# EasyEDA Pro project 通信+控制电路板.epro, schematic Schematic2
Board Name: Board2; Create Date: 2025-07-15; Page Name: P1; Project Name: 机器狗分电通信板; Schematic Name: Schematic2; Update Date: 2025-07-18; Company: 嘉立创EDA; Page Size: A4; Version: V1.0
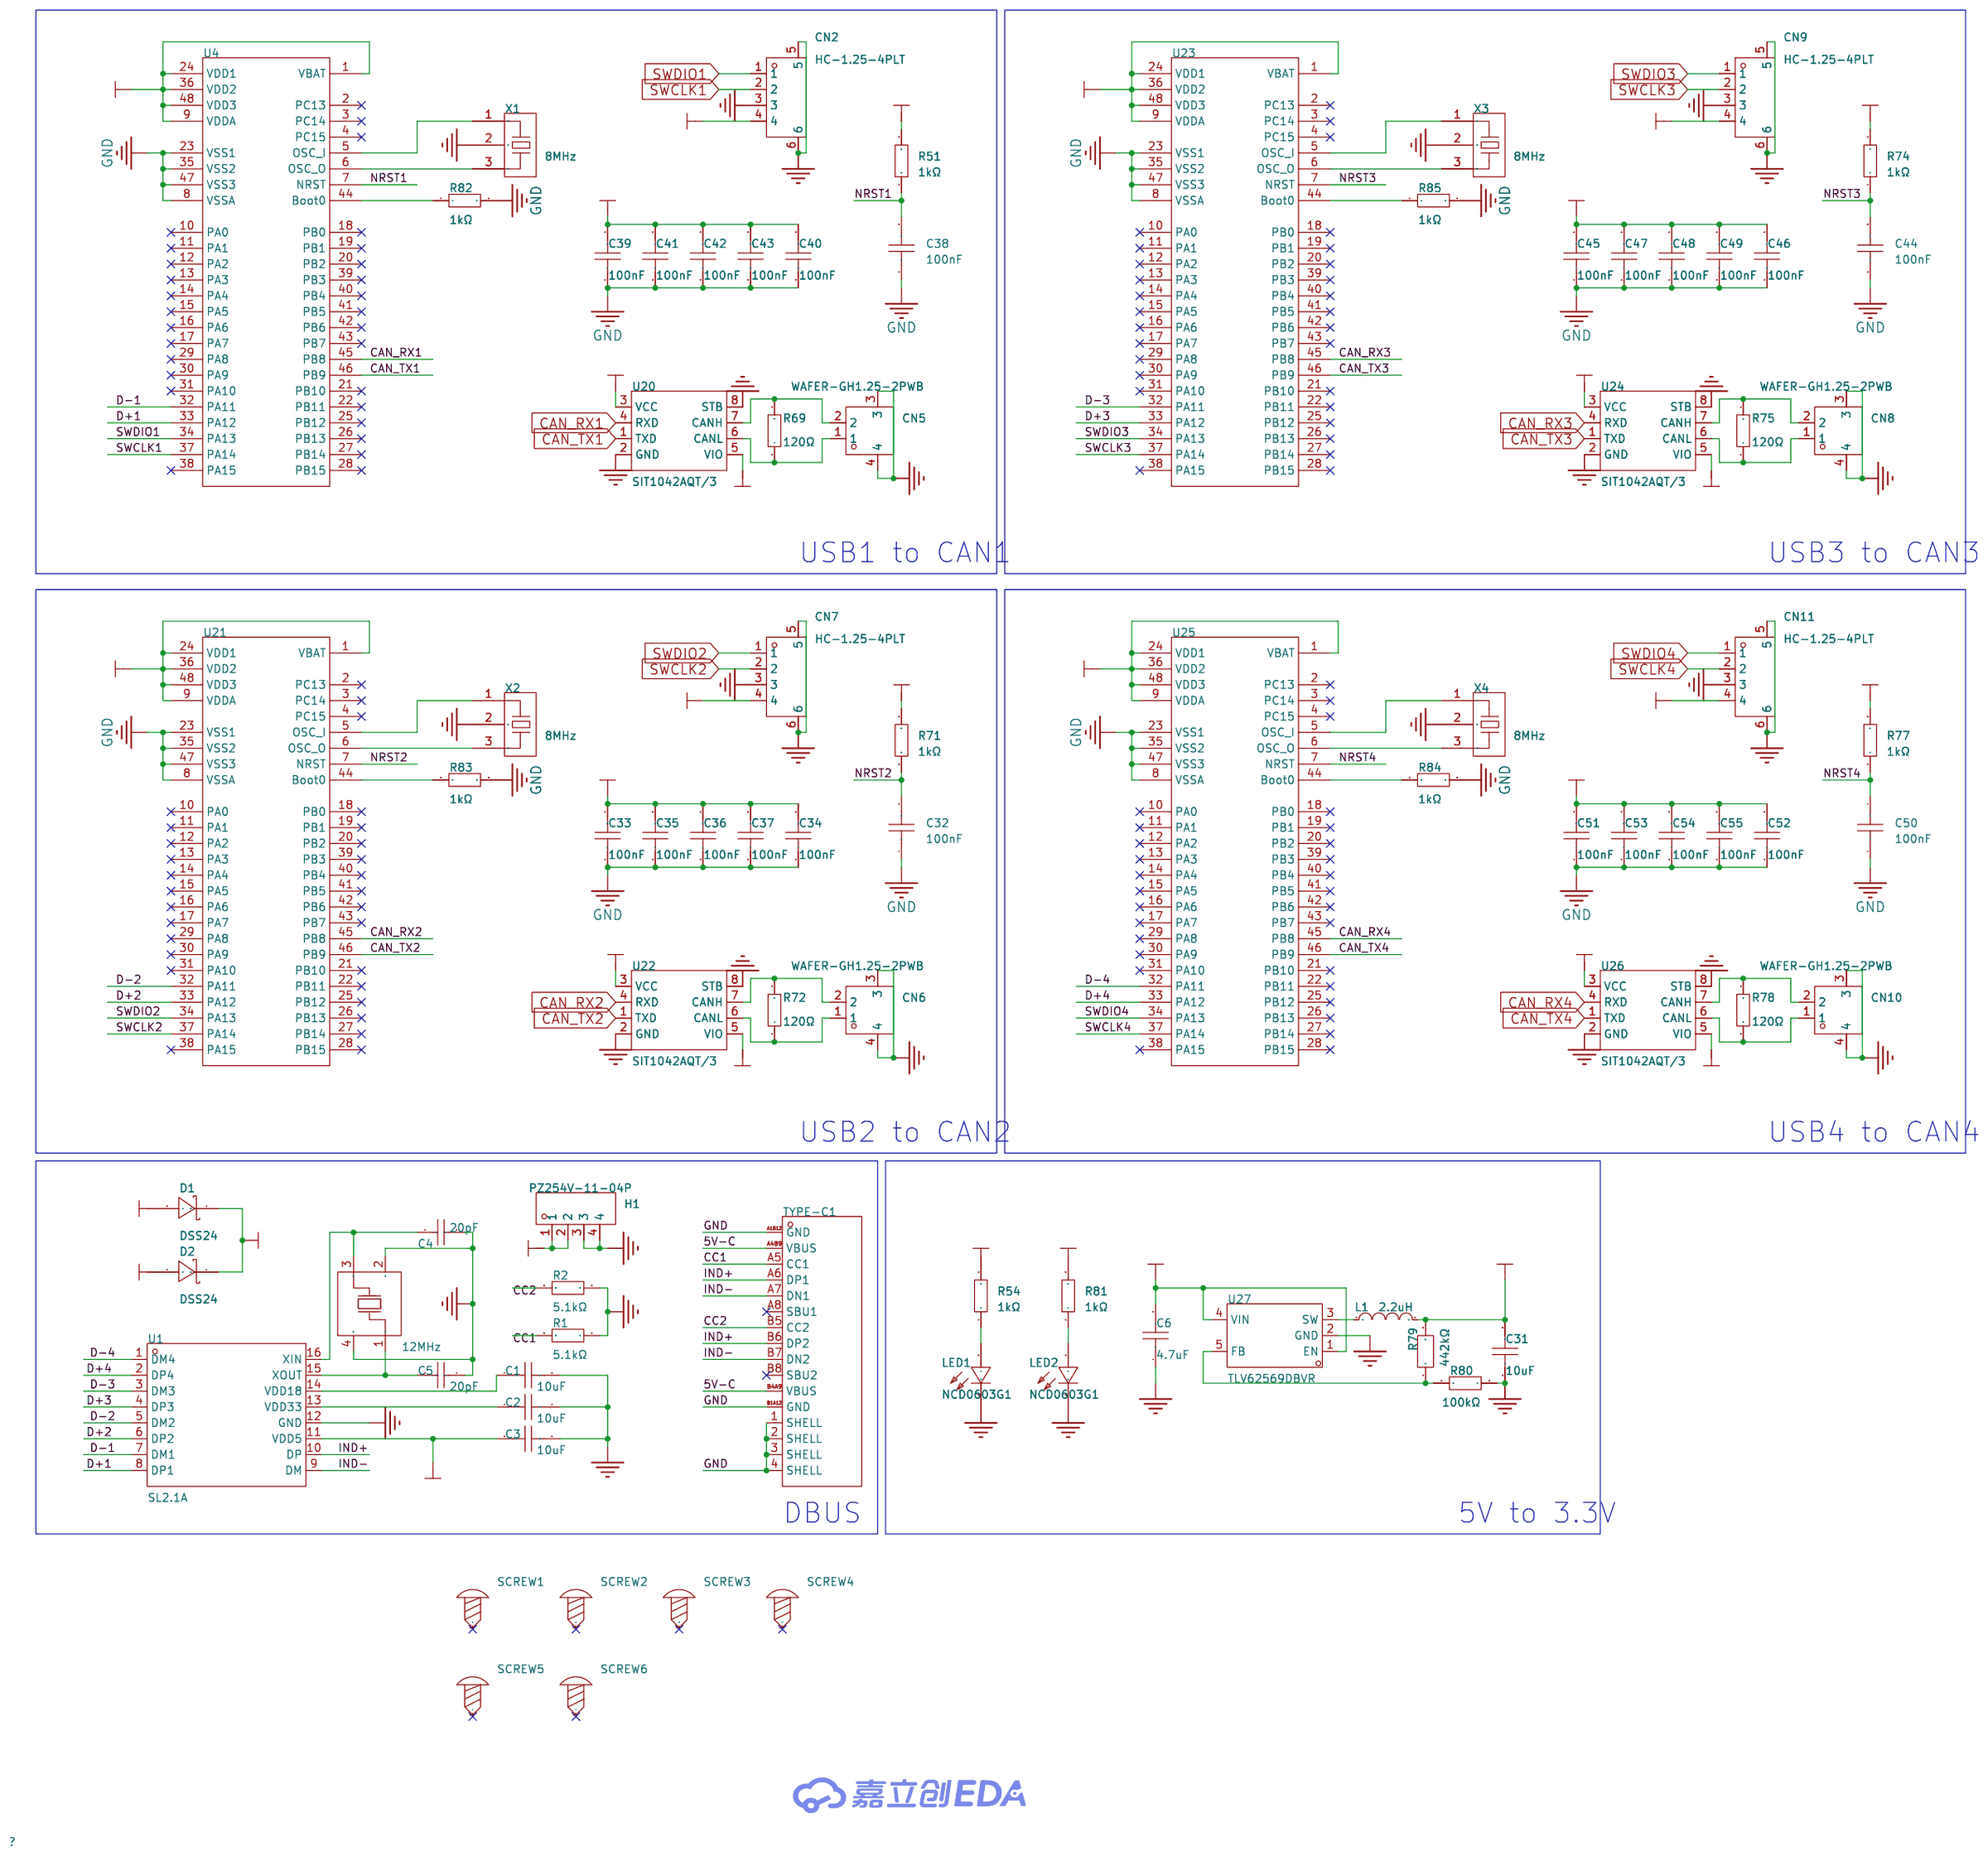
[diagram p1: schematic sheet]

## Parts
C1  10uF  [C0603]
C2  10uF  [C0603]
C3  10uF  [C0603]
C4  20pF  [C0603]
C5  20pF  [C0603]
C6  4.7uF  [C0603]
C31  10uF  [C0603]
C32  100nF  [C0603]
C33  100nF  [C0603]
C34  100nF  [C0603]
C35  100nF  [C0603]
C36  100nF  [C0603]
C37  100nF  [C0603]
C38  100nF  [C0603]
C39  100nF  [C0603]
C40  100nF  [C0603]
C41  100nF  [C0603]
C42  100nF  [C0603]
C43  100nF  [C0603]
C44  100nF  [C0603]
C45  100nF  [C0603]
C46  100nF  [C0603]
C47  100nF  [C0603]
C48  100nF  [C0603]
C49  100nF  [C0603]
C50  100nF  [C0603]
C51  100nF  [C0603]
C52  100nF  [C0603]
C53  100nF  [C0603]
C54  100nF  [C0603]
C55  100nF  [C0603]
CN2  HC-1.25-4PLT  [CONN-SMD_4P-P1.25_HCTL_HC-1.25-4PLT]
CN5  WAFER-GH1.25-2PWB  [CONN-TH_2P-P1.25_XUNPU_WAFER-GH1.25-2PWB]
CN6  WAFER-GH1.25-2PWB  [CONN-TH_2P-P1.25_XUNPU_WAFER-GH1.25-2PWB]
CN7  HC-1.25-4PLT  [CONN-SMD_4P-P1.25_HCTL_HC-1.25-4PLT]
CN8  WAFER-GH1.25-2PWB  [CONN-TH_2P-P1.25_XUNPU_WAFER-GH1.25-2PWB]
CN9  HC-1.25-4PLT  [CONN-SMD_4P-P1.25_HCTL_HC-1.25-4PLT]
CN10  WAFER-GH1.25-2PWB  [CONN-TH_2P-P1.25_XUNPU_WAFER-GH1.25-2PWB]
CN11  HC-1.25-4PLT  [CONN-SMD_4P-P1.25_HCTL_HC-1.25-4PLT]
D1  DSS24  [SOD-123_L2.8-W1.8-LS3.7-RD]
D2  DSS24  [SOD-123_L2.8-W1.8-LS3.7-RD]
H1  PZ254V-11-04P  [HDR-TH_4P-P2.54-V-M]
L1  2.2uH  [IND-SMD_L4.4-W4.2]
LED1  NCD0603G1  [LED0603-RD_1]
LED2  NCD0603G1  [LED0603-RD_1]
R1  5.1kΩ  [R0603]
R2  5.1kΩ  [R0603]
R51  1kΩ  [R0603]
R54  1kΩ  [R0603]
R69  120Ω  [R0603]
R71  1kΩ  [R0603]
R72  120Ω  [R0603]
R74  1kΩ  [R0603]
R75  120Ω  [R0603]
R77  1kΩ  [R0603]
R78  120Ω  [R0603]
R79  442kΩ  [R0603]
R80  100kΩ  [R0603]
R81  1kΩ  [R0603]
R82  1kΩ  [R0603]
R83  1kΩ  [R0603]
R84  1kΩ  [R0603]
R85  1kΩ  [R0603]
SCREW1  -  [M2螺丝]
SCREW2  -  [M2螺丝]
SCREW3  -  [M2螺丝]
SCREW4  -  [M2螺丝]
SCREW5  -  [M2螺丝]
SCREW6  -  [M2螺丝]
TYPE-C1  TYPE-C16PIN  [TYPE-C 16P 插件]
U1  SL2.1A  [SOP-16_L10.0-W3.9-P1.27-LS6.0-BL]
U4  STM32F072C8T6  [LQFP-48_L7.0-W7.0-P0.50-LS9.0-BL]
U20  SIT1042AQT/3  [SOIC-8_L4.9-W3.9-P1.27-LS6.0-BL]
U21  STM32F072C8T6  [LQFP-48_L7.0-W7.0-P0.50-LS9.0-BL]
U22  SIT1042AQT/3  [SOIC-8_L4.9-W3.9-P1.27-LS6.0-BL]
U23  STM32F072C8T6  [LQFP-48_L7.0-W7.0-P0.50-LS9.0-BL]
U24  SIT1042AQT/3  [SOIC-8_L4.9-W3.9-P1.27-LS6.0-BL]
U25  STM32F072C8T6  [LQFP-48_L7.0-W7.0-P0.50-LS9.0-BL]
U26  SIT1042AQT/3  [SOIC-8_L4.9-W3.9-P1.27-LS6.0-BL]
U27  TLV62569DBVR  [SOT-23-5_L3.0-W1.7-P0.95-LS2.8-BR]
X1  8MHz  [OSC-SMD_3P-L3.2-W1.3-P1.2-L]
X2  8MHz  [OSC-SMD_3P-L3.2-W1.3-P1.2-L]
X3  8MHz  [OSC-SMD_3P-L3.2-W1.3-P1.2-L]
X4  8MHz  [OSC-SMD_3P-L3.2-W1.3-P1.2-L]
Y1  12MHz  [3225 贴片晶振_1]

## Library data of the parts
C1-C3 C31 = CGA0603X5R106K100JT: 容值:10uF;精度:±10%;额定电压:10V;温度系数:X5R;; LCSC Part Name: 10uF ±10% 10V; Supplier Part: C6119842; Manufacturer: HRE(芯声); Supplier Footprint: 0603; JLCPCB Part Class: 扩展库; Supplier: LCSC; Tolerance: ±10%; Voltage Rating: 10V; Temperature Coefficient: X5R
C4 C5 = CL10C200JB8NNNC: 容值:20pF;精度:±5%;额定电压:50V;材质(温度系数):C0G;; LCSC Part Name: 20pF ±5% 50V; Supplier Part: C1648; Manufacturer: SAMSUNG(三星); Supplier Footprint: 0603; JLCPCB Part Class: 基础库; Datasheet: https://atta.szlcsc.com/upload/public/pdf/source/20160218/1457707763339.pdf; Supplier: LCSC; Tolerance: ±5%; Voltage Rated: 50V; Temperature Coefficient: C0G
C6 = CL10A475KO8NNNC: 容值:4.7uF;精度:±10%;额定电压:16V;材质(温度系数):X5R;; LCSC Part Name: 4.7uF ±10% 16V; Supplier Part: C19666; Manufacturer: SAMSUNG(三星); Supplier Footprint: 0603; JLCPCB Part Class: 基础库; Datasheet: https://atta.szlcsc.com/upload/public/pdf/source/20160218/1457707763339.pdf; Supplier: LCSC; Tolerance: ±10%; Voltage Rated: 16V; Temperature Coefficient: X5R
C32-C55 = CGA0603X7R104K500JT: 容值:100nF;精度:±10%;额定电压:50V;温度系数:X7R;; LCSC Part Name: 100nF ±10% 50V; Supplier Part: C6119867; Manufacturer: HRE(芯声); Supplier Footprint: 0603; JLCPCB Part Class: 扩展库; Datasheet: https://atta.szlcsc.com/upload/public/pdf/source/20250103/C44077DA9E7B3EFAE02F22B6D3D1CBC9.pdf; Supplier: LCSC; Tolerance: ±10%; Voltage Rating: 50V; Temperature Coefficient: X7R
CN2 CN7 CN9 CN11 = HC-1.25-4PLT: 插针结构:1x4P;间距:1.25mm;安装方式:立贴;参考系列:PicoBlade(MX 1.25);总PIN数:4P;排数:1;每排PIN数:4;行距:-;额定电流:2A;触头材质:黄铜;触头镀层:锡;工作温度范围:-25℃~+85℃;; LCSC Part Name: 1x4P 间距:1.25mm 立贴 系列:PicoBlade(MX 1.25); Supplier Part: C2845390; Manufacturer: HCTL(华灿天禄); Supplier Footprint: SMD,P=1.25mm; JLCPCB Part Class: 扩展库; Datasheet: https://atta.szlcsc.com/upload/public/pdf/source/20230707/8E5913B5A3195C18F5EE12EA4CB86B82.pdf; Supplier: LCSC; Pins Structure: 1x4P; Pitch: 1.25mm; Mounting Style: 立贴; Reference Series: PicoBlade(MX 1.25); Number of Pins: 4P; Number of Rows: 1; Number of PINs Per Row: 4; Current Rating (Max): 2A; Contact Material: 黄铜; Contact Plating: 锡; Operating Temperature Range: -25℃~+85℃; Rated Voltage (Max): 250V; Plastic Material: LCP; Flame Retardant Rating: UL94V-0; Supplementary Features: 辅助焊脚; Z-Height of the Board: 4.75mm; X-Length of Bottom Edge on Board (Spacing Line): 9.8mm; Y-Width of Bottom Edge on Board: 4.2mm
CN5 CN6 CN8 CN10 = WAFER-GH1.25-2PWB: 插针结构:1x2P;间距:1.25mm;安装方式:卧贴;参考系列:GH;总PIN数:2P;排数:1;每排PIN数:2;行距:-;额定电流:1A;触头材质:黄铜;触头镀层:-;工作温度范围:-25℃~+85℃;; LCSC Part Name: 1x2P 间距:1.25mm 卧贴 系列:GH; Supplier Part: C3029377; Manufacturer: XUNPU(讯普); Supplier Footprint: SMD,P=1.25mm,卧贴; JLCPCB Part Class: 扩展库; Datasheet: https://atta.szlcsc.com/upload/public/pdf/source/20220527/CB8773BFB0913C3B8ABD62CB38BA101A.pdf; Supplier: LCSC; Pins Structure: 1x2P; Pitch: 1.25mm; Mounting Type: 卧贴; Reference Series: GH; Number of Pins: 2P; Number of Rows: 1; Number of PINs Per Row: 2; Current Rating: 1A; Contact Material: 黄铜; Operating Temperature: -25℃~+85℃; Voltage Rating: 125V; Plastic Material: LCP; Supplementary Features: 辅助焊脚; Color: 米色; Z-Height of the Board: 4.35mm; X-Length of Bottom Edge on Board (Spacing Line): 5.75mm; Y-Width of Bottom Edge on Board: 5mm
D1 D2 = DSS24: 正向压降(Vf):550mV@2A;直流反向耐压(Vr):40V;整流电流:2A;; LCSC Part Name: 电压:40V 电流:2A; Supplier Part: C511865; Manufacturer: BORN(伯恩半导体); Supplier Footprint: SOD-123FL; JLCPCB Part Class: 扩展库; Datasheet: https://atta.szlcsc.com/upload/public/pdf/source/20200413/C511865_530A4A8DFA4BF76EA49400B00C28BC33.pdf; Supplier: LCSC; Voltage - Forward(Vf@If): 550mV@2A; Voltage - DC Reverse(Vr): 40V; Current - Rectified: 2A
H1 = PZ254V-11-04P: 插针结构:1x4P;间距:2.54mm;行距:-;圆针/方针:方针;安装类型:直插;排数:单排;总PIN位数:4P;额定电流:3A;额定电压:250V;配合针长度:6mm;塑高:2.5mm;端接针长度:3mm;触头材质:-;工作温度范围:-40℃~+105℃;颜色:黑色;; LCSC Part Name: 间距:2.54mm 1x4P 直插 方针; Supplier Part: C2691448; Manufacturer: XFCN(兴飞); Supplier Footprint: 插件,P=2.54mm; JLCPCB Part Class: 扩展库; Datasheet: https://atta.szlcsc.com/upload/public/pdf/source/20200309/C492403_F9F19131791D08044AD4F84F8E751A34.pdf; Supplier: LCSC; Pin Structure: 1x4P; Pitch: 2.54mm; Circluar Pins/Square Pins: 方针; Mounting Type: 直插; Number of Rows: 单排; Number of Pins: 4P; Current Rating (Max): 3A; Voltage Rating (Max): 250V; Length of Mating Pin: 6mm; Insulation Height: 2.5mm; Length of End Connection Pin: 3mm; Operating Temperature Range: -40℃~+105℃; Color: 黑色
L1 = FXL0420-2R2-M: 电感值:2.2uH;精度:±20%;额定电流:4.5A;饱和电流(Isat):5A;类型:一体成型电感;; LCSC Part Name: 2.2uH ±20% 5A; Supplier Part: C167206; Manufacturer: cjiang(长江微电); Supplier Footprint: SMD,4.2x4.4mm; JLCPCB Part Class: 扩展库; Datasheet: https://atta.szlcsc.com/upload/public/pdf/source/20240426/3189EA8206330E2108542F9E34E540E7.pdf; Supplier: LCSC; Tolerance: ±20%; Rated Current: 4.5A; Saturation Current (Isat): 5A; DC Resistance (DCR): 58mΩ; Type: 一体成型电感
LED1 LED2 = NCD0603G1: 发光颜色:翠绿色;正向压降(Vf):2.6V~3.6V;功率:72mW;正向电流:20mA;波长:515nm~530nm;透镜颜色:-;发光强度:330mcd~900mcd;发光角度:130°;工作温度:-30℃~+85℃;; Supplier Part: C84267; Manufacturer: 国星光电; Supplier Footprint: 0603; JLCPCB Part Class: 扩展库; Datasheet: https://atta.szlcsc.com/upload/public/pdf/source/20200820/C84267_04BA7703640BAC111D09F5EFB971FBF3.pdf; Supplier: LCSC; Illumination Color: 翠绿色; Voltage - Forward(Vf): 2.6V~3.6V; Power(Watts): 72mW; Forward Current: 20mA; Wavelength - Dominant: 515nm~530nm; Luminous Intensity: 330mcd~900mcd; Viewing Angle: 130°; Operating Temperature: -30℃~+85℃
R1 R2 = 0603WAF5101T5E: 电阻类型:厚膜电阻;阻值:5.1kΩ;精度:±1%;功率:100mW;最大工作电压:75V;温度系数:±100ppm/℃;; LCSC Part Name: 5.1kΩ ±1% 100mW 厚膜电阻; Supplier Part: C23186; Manufacturer: UNI-ROYAL(厚声); Supplier Footprint: 0603; JLCPCB Part Class: 基础库; Datasheet: https://atta.szlcsc.com/upload/public/pdf/source/20200306/C422600_1E6D84923E4A46A82E41ADD87F860B5C.pdf; Supplier: LCSC; Type: 厚膜电阻; Tolerance: ±1%; Power(Watts): 100mW; Overload Voltage (Max): 75V; Temperature Coefficient: ±100ppm/℃; Operating Temperature Range: -55℃~+155℃
R51 R54 R71 R74 R77 R81-R85 = 0603WAF1001T5E: 电阻类型:厚膜电阻;阻值:1kΩ;精度:±1%;功率:100mW;最大工作电压:75V;温度系数:±100ppm/℃;; LCSC Part Name: 1kΩ ±1% 100mW 厚膜电阻; Supplier Part: C21190; Manufacturer: UNI-ROYAL(厚声); Supplier Footprint: 0603; JLCPCB Part Class: 基础库; Datasheet: https://atta.szlcsc.com/upload/public/pdf/source/20200306/C422600_1E6D84923E4A46A82E41ADD87F860B5C.pdf; Supplier: LCSC; Type: 厚膜电阻; Tolerance: ±1%; Power(Watts): 100mW; Overload Voltage (Max): 75V; Temperature Coefficient: ±100ppm/℃; Operating Temperature Range: -55℃~+155℃
R69 R72 R75 R78 = 0603WAF1200T5E: 电阻类型:厚膜电阻;阻值:120Ω;精度:±1%;功率:100mW;最大工作电压:75V;温度系数:±100ppm/℃;; LCSC Part Name: 120Ω ±1% 100mW 厚膜电阻; Supplier Part: C22787; Manufacturer: UNI-ROYAL(厚声); Supplier Footprint: 0603; JLCPCB Part Class: 基础库; Datasheet: https://atta.szlcsc.com/upload/public/pdf/source/20200306/C422600_1E6D84923E4A46A82E41ADD87F860B5C.pdf; Supplier: LCSC; Type: 厚膜电阻; Tolerance: ±1%; Power(Watts): 100mW; Overload Voltage (Max): 75V; Temperature Coefficient: ±100ppm/℃; Operating Temperature Range: -55℃~+155℃
R79 = FRH0603D4423TS: 电阻类型:厚膜电阻;阻值:442kΩ;精度:±0.5%;功率:100mW;最大工作电压:75V;温度系数:±100ppm/℃;; LCSC Part Name: 442kΩ ±0.5% 100mW 厚膜电阻; Supplier Part: C3013343; Manufacturer: FOJAN(富捷); Supplier Footprint: 0603; JLCPCB Part Class: 扩展库; Datasheet: https://atta.szlcsc.com/upload/public/pdf/source/20211221/925EC7D7225764EE0046F22065062C87.pdf; Supplier: LCSC; Type: 厚膜电阻; Tolerance: ±0.5%; Power(Watts): 100mW; Overload Voltage (Max): 75V; Temperature Coefficient: ±100ppm/℃
R80 = 0603WAF1003T5E: 电阻类型:厚膜电阻;阻值:100kΩ;精度:±1%;功率:100mW;最大工作电压:75V;温度系数:±100ppm/℃;; LCSC Part Name: 100kΩ ±1% 100mW 厚膜电阻; Supplier Part: C25803; Manufacturer: UNI-ROYAL(厚声); Supplier Footprint: 0603; JLCPCB Part Class: 基础库; Datasheet: https://atta.szlcsc.com/upload/public/pdf/source/20200306/C422600_1E6D84923E4A46A82E41ADD87F860B5C.pdf; Supplier: LCSC; Type: 厚膜电阻; Tolerance: ±1%; Power(Watts): 100mW; Overload Voltage (Max): 75V; Temperature Coefficient: ±100ppm/℃; Operating Temperature Range: -55℃~+155℃
SCREW1-SCREW6 = M2螺丝: Supplier Footprint: 插件
TYPE-C1 = TYPE-C 16P 插件: 连接器类型:Type-C;标准:-;公母:母座;触点数量:16;端口数量:1;安装方式:卧贴;额定电流 - 电源:3A;工作温度范围:-40℃~+85℃;; Supplier Part: C393939; Supplier: LCSC; Connector Type: Type-C; Gender: 母座; Number of Contacts: 16; Mounting Style: 卧贴; Current Rating - Power (Max): 3A; Operating Temperature Range: -40℃~+85℃; JLCPCB Part Class: 扩展库
U1 = SL2.1A: SL2.1A是一颗高集成度,高性能,低功耗的USB2.0集线器主控芯片，支持USB2.0高速(480MHz),全速(12MHz)和低速模式(1.5MHz)，内置12MHz晶体振荡器。; LCSC Part Name: USB2.0高速4端口HUB控制器; Supplier Part: C192893; Manufacturer: CoreChips(和芯润德); Supplier Footprint: SOP-16; JLCPCB Part Class: 扩展库; Datasheet: https://atta.szlcsc.com/upload/public/pdf/source/20180522/C192893_624110D24898D57AAC785E3DF98EA862.pdf; Supplier: LCSC
U4 U21 U23 U25 = STM32F072C8T6: 工作电压:1.65V ~ 3.6V;CPU内核:ARM® Cortex®-M0;; Supplier Part: C80488; Manufacturer: ST(意法半导体); Supplier Footprint: LQFP-48_7x7x05P; JLCPCB Part Class: Extended Part; Datasheet: https://atta.szlcsc.com/upload/public/pdf/source/20160816/1471343013459.pdf; Supplier: LCSC; Features: I2S,HDMI CEC; UART/USART: 4 USART; USB Device: 1; PWM: 6; I2C（SMBUS/PMBUS）: 2; Voltage - Supply (Vcc/Vdd): 1.65V ~ 3.6V; CAN: 1; A/D: 10x12bit; D/A: 2x12bit; Core Processor: ARM® Cortex®-M0; Program Memory Size: 64KB; RAM Size: 16KB; Number of I/O: 37
U20 U22 U24 U26 = SIT1042AQT/3: 类型:CAN-FD收发器;数据速率:5Mbps;; Supplier Part: C5382542; Manufacturer: SIT(芯力特); Supplier Footprint: SOP-8; JLCPCB Part Class: 扩展库; Datasheet: https://atta.szlcsc.com/upload/public/pdf/source/20240906/D3430A363AE1D9ADB7ADD9C550EC5EB2.pdf; Supplier: LCSC; Type: CAN-FD收发器; Data Rate: 5Mbps; Supply Voltage: 4.5V~5.5V
U27 = TLV62569DBVR: 功能类型:降压型;输出类型:可调;工作电压:2.5V~5.5V;输出电压:600mV~5.5V;输出电流:2A;; LCSC Part Name: 高效率同步降压转换器; Supplier Part: C141836; Manufacturer: TI(德州仪器); Supplier Footprint: SOT-23-5; JLCPCB Part Class: 扩展库; Datasheet: https://www.ti.com/cn/lit/gpn/tlv62569; Supplier: LCSC; Function: 降压型; Output Type: 可调; Voltage - Supply: 2.5V~5.5V; Output Voltage: 600mV~5.5V; Output Current: 2A; Frequency - Switching: 1.5MHz; Operating Temperature: -40℃~+125℃@(TJ); Synchronous Rectifier: 是; Number of Outputs: 1; Topology: 降压式; Switch tube (built-in/external): 内置
X1-X4 = CSTCE8M00G15C99-R0: 频率:8MHz;内置负载电容:33pF;谐振阻抗:40Ω;; LCSC Part Name: 8MHz ±0.1% 内置负载电容:33pF; Supplier Part: C110614; Manufacturer: muRata(村田); Supplier Footprint: SMD3213-3P; JLCPCB Part Class: 扩展库; Datasheet: https://atta.szlcsc.com/upload/public/pdf/source/20180327/C110614_9F5031E08ADB10DE4472527BF78A8CAF.pdf; Supplier: LCSC; Built-in Load Capacitance: 33pF; Resonant Impedance: 40Ω; Operating Temperature: -40℃~+125℃
Y1 = 3225 贴片晶振_1: 晶振类型:贴片无源晶振;频率:12MHz;频率公差:±10ppm;频率稳定度:±30ppm;负载电容:20pF;工作温度:-40℃~+85℃;; LCSC Part Name: YSX321SL 12MHz ±10ppm 20pF; Supplier Part: C9002; Manufacturer: YXC(扬兴晶振); Manufacturer Part: X322512MSB4SI; Supplier Footprint: SMD3225-4P; JLCPCB Part Class: 基础库; Datasheet: https://atta.szlcsc.com/upload/public/pdf/source/20210329/C112971_1F611BDC486E193C1706F6D8EB5AA189.pdf; Supplier: LCSC; Crystal Type: 贴片无源晶振; Frequency Tolerance: ±10ppm; Frequency Stability: ±30ppm; Load Capacitance: 20pF; Operating Temperature: -40℃~+85℃

## Nets
3V3: C31.2 C33.2 C34.2 C35.2 C36.2 C37.2 C39.2 C40.2 C41.2 C42.2 C43.2 C45.2 C46.2 C47.2 C48.2 C49.2 C51.2 C52.2 C53.2 C54.2 C55.2 CN2.4 CN7.4 CN9.4 CN11.4 L1.2 R51.2 R54.2 R71.2 R74.2 R77.2 R79.2 U4.1(VBAT) U4.9(VDDA) U4.24(VDD1) U4.36(VDD2) U4.48(VDD3) U20.5(VIO) U21.1(VBAT) U21.9(VDDA) U21.24(VDD1) U21.36(VDD2) U21.48(VDD3) U22.5(VIO) U23.1(VBAT) U23.9(VDDA) U23.24(VDD1) U23.36(VDD2) U23.48(VDD3) U24.5(VIO) U25.1(VBAT) U25.9(VDDA) U25.24(VDD1) U25.36(VDD2) U25.48(VDD3) U26.5(VIO)
5V: C3.1 C6.2 D1.1(C) D2.1(C) R81.2 U1.11(VDD5) U20.3(VCC) U22.3(VCC) U24.3(VCC) U26.3(VCC) U27.1(EN) U27.4(VIN)
5V-C: D2.2(A) TYPE-C1.A4B9(VBUS) TYPE-C1.B4A9(VBUS)
5V-DC: D1.2(A) H1.1 H1.2
GND: C1.2 C2.2 C3.2 C4.2 C5.2 C6.1 C31.1 C32.1 C33.1 C34.1 C35.1 C36.1 C37.1 C38.1 C39.1 C40.1 C41.1 C42.1 C43.1 C44.1 C45.1 C46.1 C47.1 C48.1 C49.1 C50.1 C51.1 C52.1 C53.1 C54.1 C55.1 CN2.3 CN2.5 CN2.6 CN5.3 CN5.4 CN6.3 CN6.4 CN7.3 CN7.5 CN7.6 CN8.3 CN8.4 CN9.3 CN9.5 CN9.6 CN10.3 CN10.4 CN11.3 CN11.5 CN11.6 H1.3 H1.4 LED1.1(K) LED2.1(K) R1.1 R2.1 R80.1 R82.2 R83.2 R84.2 R85.2 TYPE-C1.1(SHELL) TYPE-C1.2(SHELL) TYPE-C1.3(SHELL) TYPE-C1.4(SHELL) TYPE-C1.A1B12(GND) TYPE-C1.B1A12(GND) U1.12(GND) U4.8(VSSA) U4.23(VSS1) U4.35(VSS2) U4.47(VSS3) U20.2(GND) U20.8(STB) U21.8(VSSA) U21.23(VSS1) U21.35(VSS2) U21.47(VSS3) U22.2(GND) U22.8(STB) U23.8(VSSA) U23.23(VSS1) U23.35(VSS2) U23.47(VSS3) U24.2(GND) U24.8(STB) U25.8(VSSA) U25.23(VSS1) U25.35(VSS2) U25.47(VSS3) U26.2(GND) U26.8(STB) U27.2(GND) X1.2 X2.2 X3.2 X4.2 Y1.2(GND) Y1.4(GND)
CAN_RX1: U4.45(PB8) U20.4(RXD)
CAN_RX2: U21.45(PB8) U22.4(RXD)
CAN_RX3: U23.45(PB8) U24.4(RXD)
CAN_RX4: U25.45(PB8) U26.4(RXD)
CAN_TX1: U4.46(PB9) U20.1(TXD)
CAN_TX2: U21.46(PB9) U22.1(TXD)
CAN_TX3: U23.46(PB9) U24.1(TXD)
CAN_TX4: U25.46(PB9) U26.1(TXD)
CC1: R1.2 TYPE-C1.A5(CC1)
CC2: R2.2 TYPE-C1.B5(CC2)
D+1: U1.8(DP1) U4.33(PA12)
D+2: U1.6(DP2) U21.33(PA12)
D+3: U1.4(DP3) U23.33(PA12)
D+4: U1.2(DP4) U25.33(PA12)
D-1: U1.7(DM1) U4.32(PA11)
D-2: U1.5(DM2) U21.32(PA11)
D-3: U1.3(DM3) U23.32(PA11)
D-4: U1.1(DM4) U25.32(PA11)
IND+: TYPE-C1.A6(DP1) TYPE-C1.B6(DP2) U1.10(DP)
IND-: TYPE-C1.A7(DN1) TYPE-C1.B7(DN2) U1.9(DM)
NRST1: C38.2 R51.1 U4.7(NRST)
NRST2: C32.2 R71.1 U21.7(NRST)
NRST3: C44.2 R74.1 U23.7(NRST)
NRST4: C50.2 R77.1 U25.7(NRST)
SWCLK1: CN2.2 U4.37(PA14)
SWCLK2: CN7.2 U21.37(PA14)
SWCLK3: CN9.2 U23.37(PA14)
SWCLK4: CN11.2 U25.37(PA14)
SWDIO1: CN2.1 U4.34(PA13)
SWDIO2: CN7.1 U21.34(PA13)
SWDIO3: CN9.1 U23.34(PA13)
SWDIO4: CN11.1 U25.34(PA13)
$1N1080: C4.1 U1.16(XIN) Y1.3(OSC2)
$1N1085: C5.1 U1.15(XOUT) Y1.1(OSC1)
$1N1217: C1.1 U1.14(VDD18)
$1N1224: C2.1 U1.13(VDD33)
$1N3104: R82.1 U4.44(Boot0)
$1N3112: U4.5(OSC_I) X1.1
$1N3113: U4.6(OSC_O) X1.3
$1N3290: LED1.2(A) R54.1
$1N3925: CN5.2 R69.2 U20.7(CANH)
$1N3926: CN5.1 R69.1 U20.6(CANL)
$1N5937: U21.5(OSC_I) X2.1
$1N5960: CN6.2 R72.2 U22.7(CANH)
$1N5961: CN6.1 R72.1 U22.6(CANL)
$1N5979: R83.1 U21.44(Boot0)
$1N5983: U21.6(OSC_O) X2.3
$1N8697: CN10.2 R78.2 U26.7(CANH)
$1N8698: CN10.1 R78.1 U26.6(CANL)
$1N8710: R84.1 U25.44(Boot0)
$1N8713: U25.6(OSC_O) X4.3
$1N8727: U25.5(OSC_I) X4.1
$1N8737: U23.5(OSC_I) X3.1
$1N8756: R85.1 U23.44(Boot0)
$1N8775: U23.6(OSC_O) X3.3
$1N8815: CN8.2 R75.2 U24.7(CANH)
$1N8816: CN8.1 R75.1 U24.6(CANL)
$1N9929: L1.1 U27.3(SW)
$1N10079: R79.1 R80.2 U27.5(FB)
$1N10342: LED2.2(A) R81.1

Not connected (* = marked no-connect by the designer): SCREW1 1*; SCREW2 1*; SCREW3 1*; SCREW4 1*; SCREW5 1*; SCREW6 1*; TYPE-C1 A8(SBU1)* B8(SBU2)*; U4 2(PC13)* 3(PC14)* 4(PC15)* 10(PA0)* 11(PA1)* 12(PA2)* 13(PA3)* 14(PA4)* 15(PA5)* 16(PA6)* 17(PA7)* 18(PB0)* 19(PB1)* 20(PB2)* 21(PB10)* 22(PB11)* 25(PB12)* 26(PB13)* 27(PB14)* 28(PB15)* 29(PA8)* 30(PA9)* 31(PA10)* 38(PA15)* 39(PB3)* 40(PB4)* 41(PB5)* 42(PB6)* 43(PB7)*; U21 2(PC13)* 3(PC14)* 4(PC15)* 10(PA0)* 11(PA1)* 12(PA2)* 13(PA3)* 14(PA4)* 15(PA5)* 16(PA6)* 17(PA7)* 18(PB0)* 19(PB1)* 20(PB2)* 21(PB10)* 22(PB11)* 25(PB12)* 26(PB13)* 27(PB14)* 28(PB15)* 29(PA8)* 30(PA9)* 31(PA10)* 38(PA15)* 39(PB3)* 40(PB4)* 41(PB5)* 42(PB6)* 43(PB7)*; U23 2(PC13)* 3(PC14)* 4(PC15)* 10(PA0)* 11(PA1)* 12(PA2)* 13(PA3)* 14(PA4)* 15(PA5)* 16(PA6)* 17(PA7)* 18(PB0)* 19(PB1)* 20(PB2)* 21(PB10)* 22(PB11)* 25(PB12)* 26(PB13)* 27(PB14)* 28(PB15)* 29(PA8)* 30(PA9)* 31(PA10)* 38(PA15)* 39(PB3)* 40(PB4)* 41(PB5)* 42(PB6)* 43(PB7)*; U25 2(PC13)* 3(PC14)* 4(PC15)* 10(PA0)* 11(PA1)* 12(PA2)* 13(PA3)* 14(PA4)* 15(PA5)* 16(PA6)* 17(PA7)* 18(PB0)* 19(PB1)* 20(PB2)* 21(PB10)* 22(PB11)* 25(PB12)* 26(PB13)* 27(PB14)* 28(PB15)* 29(PA8)* 30(PA9)* 31(PA10)* 38(PA15)* 39(PB3)* 40(PB4)* 41(PB5)* 42(PB6)* 43(PB7)*

## Notes on the sheet
- USB1 to CAN1
- USB3 to CAN3
- USB2 to CAN2
- USB4 to CAN4
- DBUS
- 5V to 3.3V
